# Altium schematic sheet Lampda_schematics_V1_1.schdoc
size 774 x 423 mm
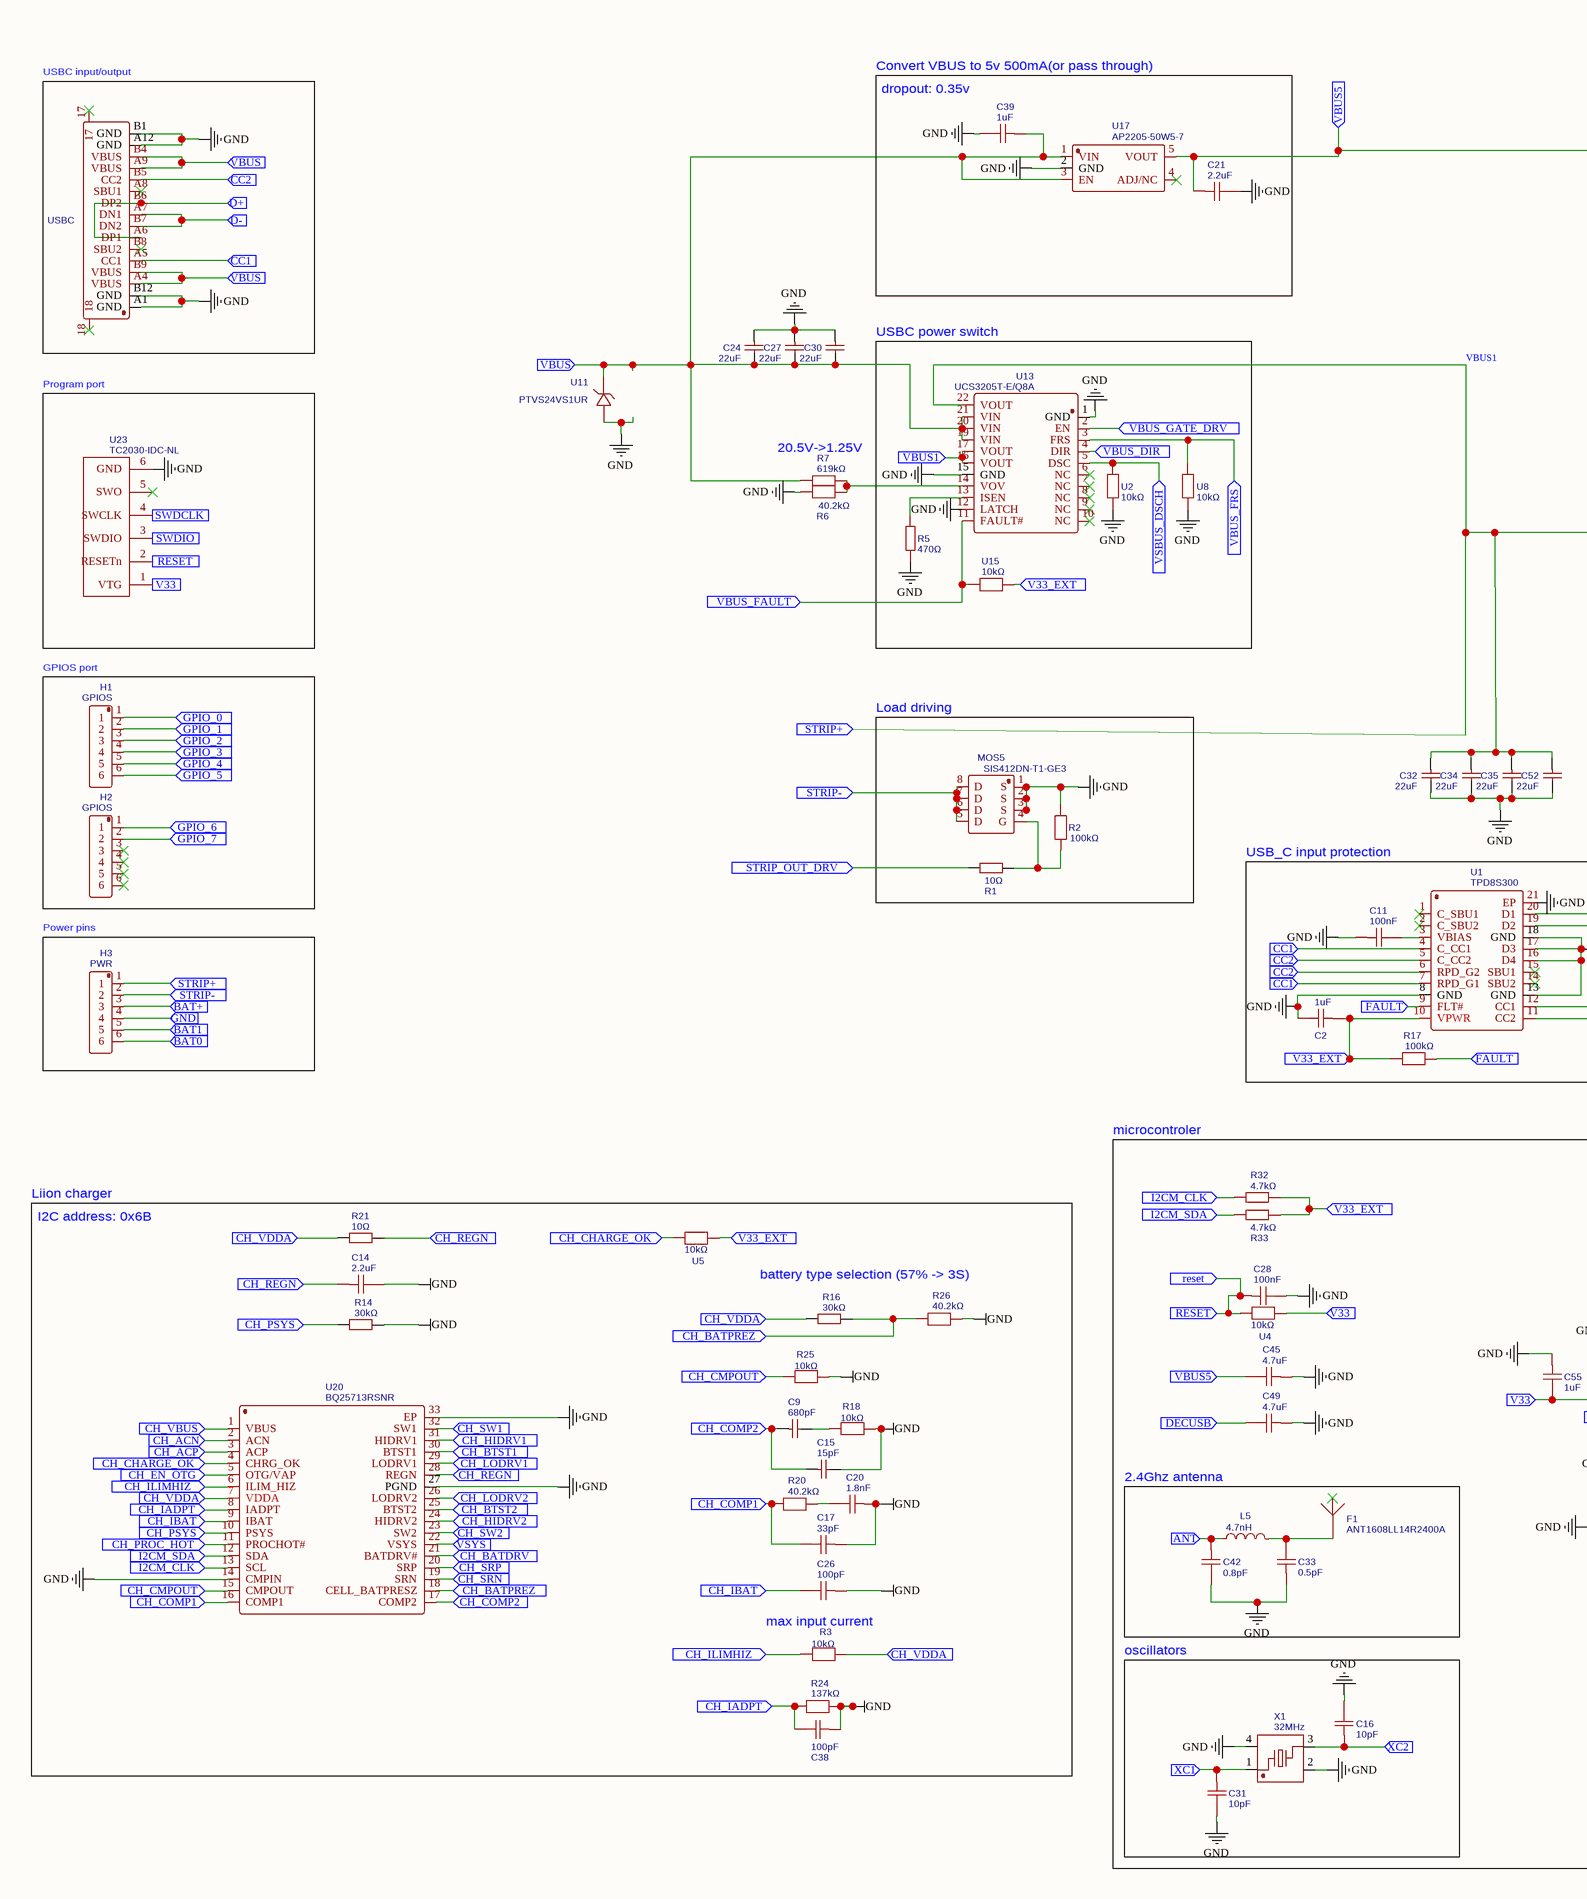
[diagram p0: Lampda_schematics_V1_1.schdoc, left]
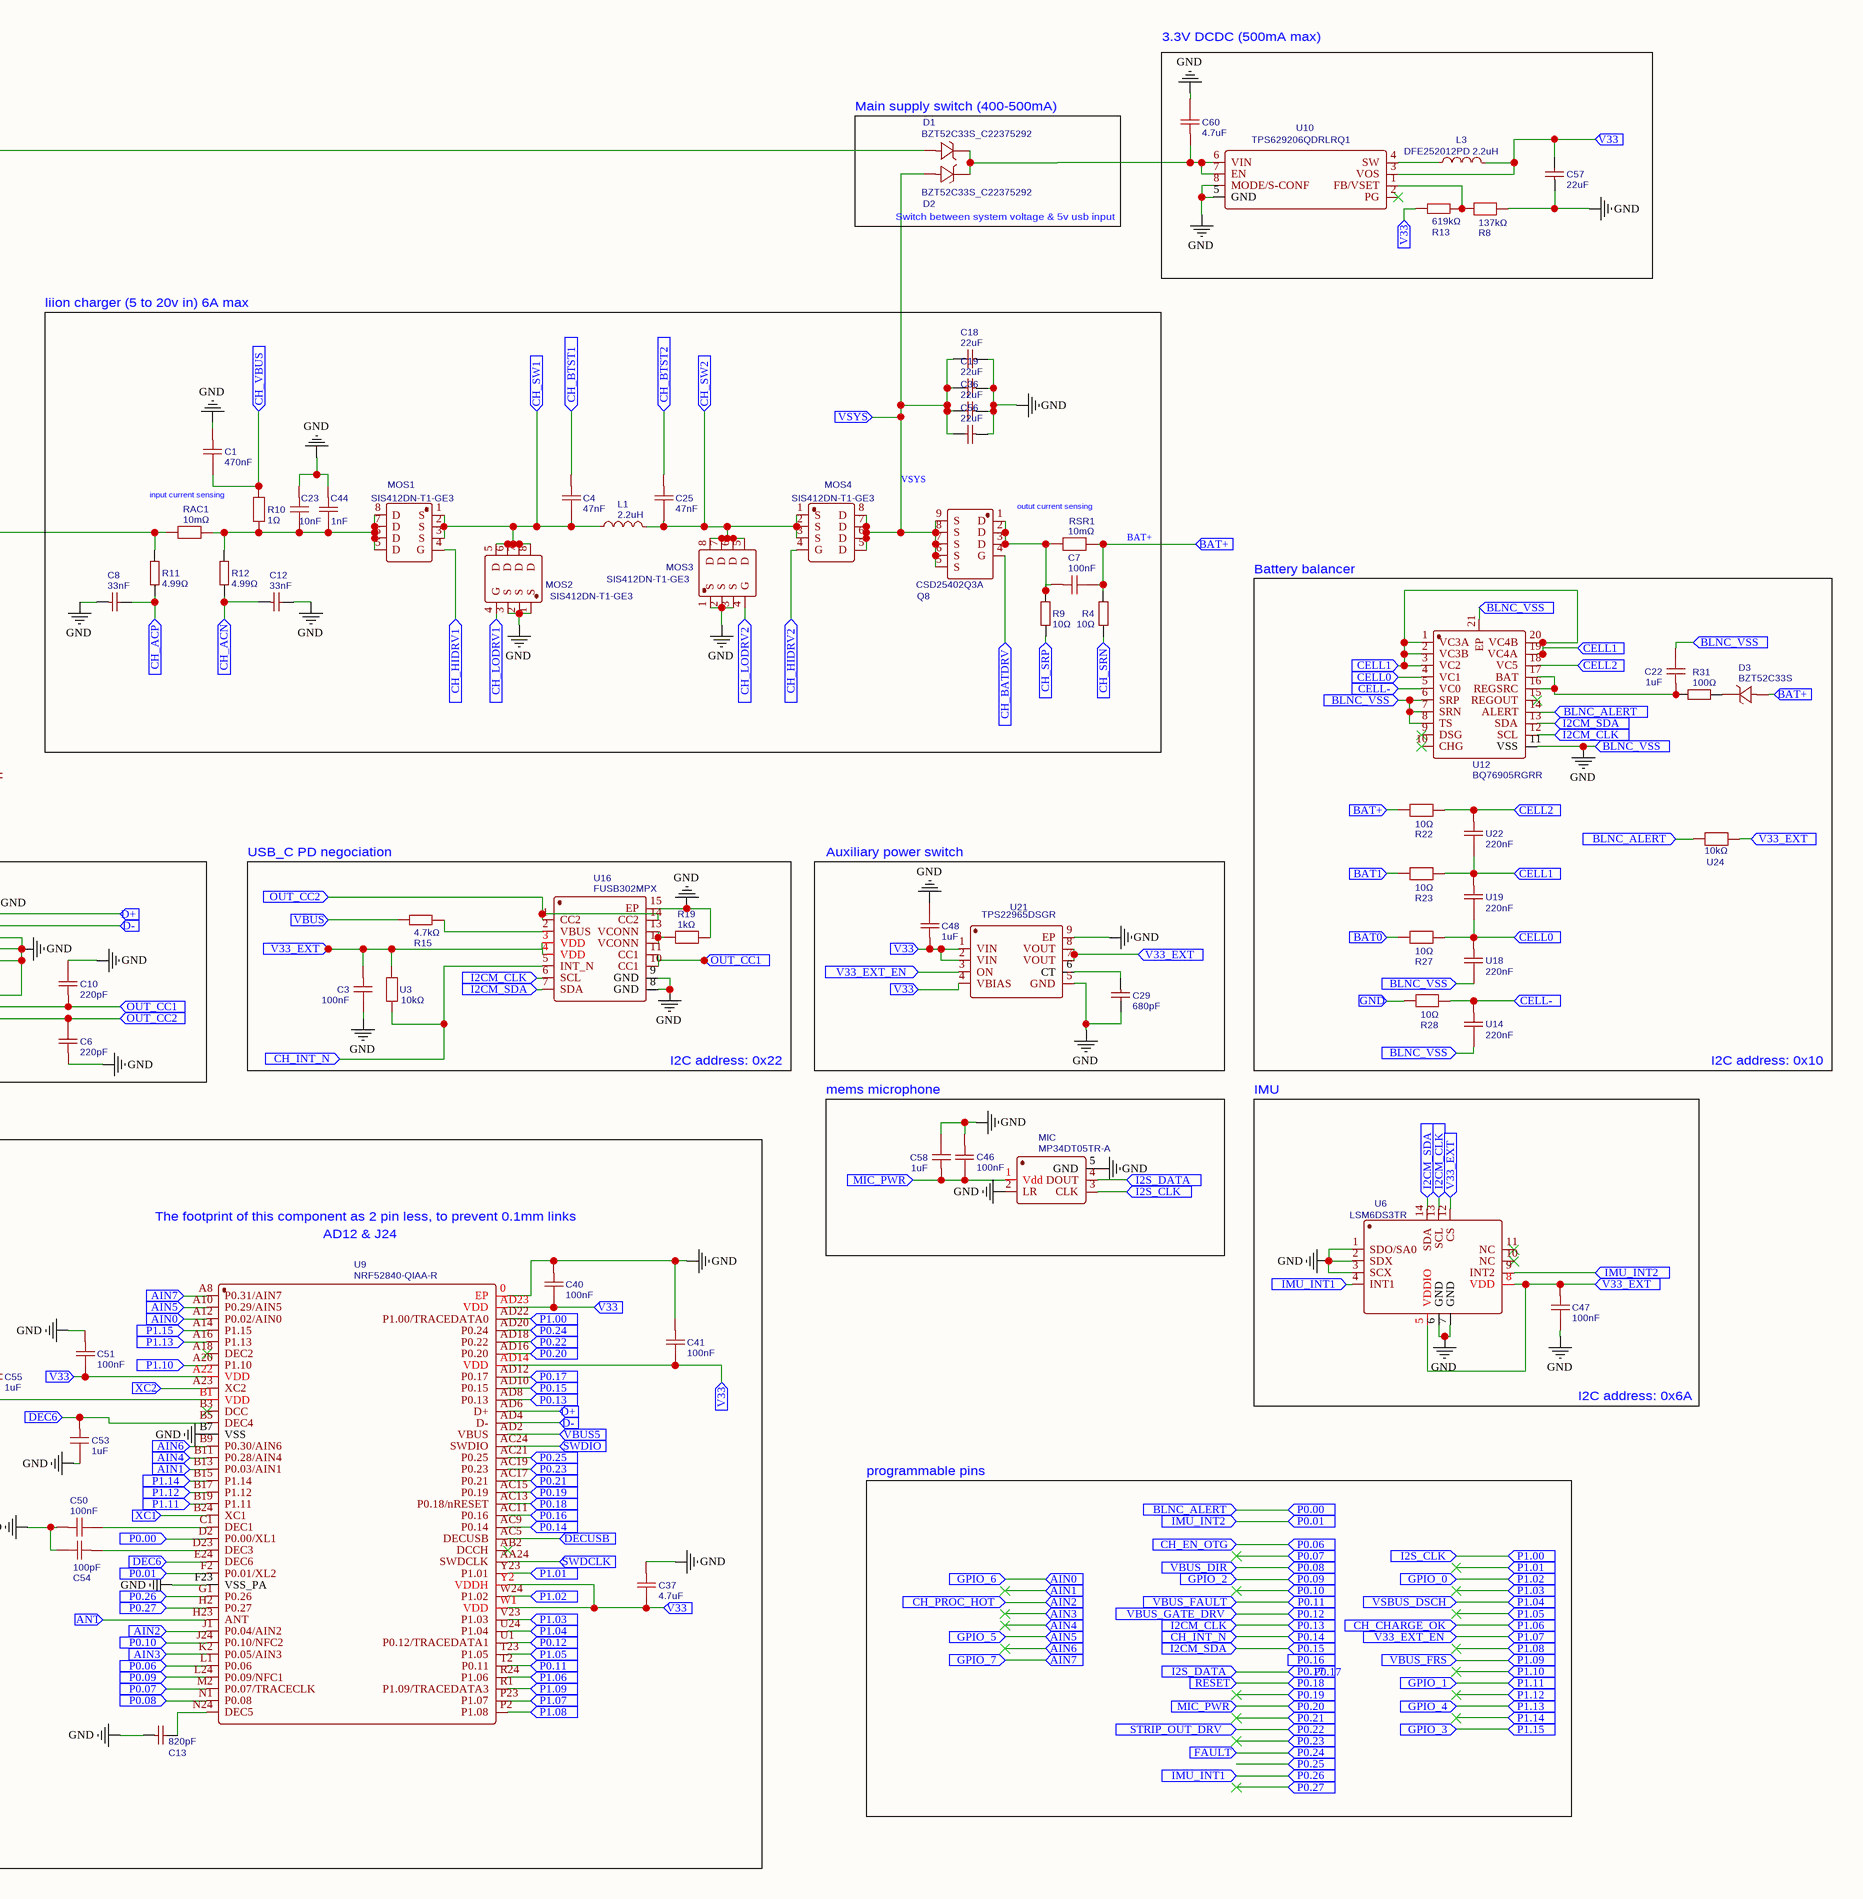
[diagram p1: Lampda_schematics_V1_1.schdoc, right]

## Parts
C1  470nF  [C0402]
C2  1uF  [C0402]
C3  100nF  [C0402]
C4  47nF  [C0402]
C6  220pF  [C0402]
C7  100nF  [C0402]
C8  33nF  [C0402]
C9  680pF  [C0402]
C10  220pF  [C0402]
C11  100nF  [C0402]
C12  33nF  [C0402]
C13  820pF  [C0402]
C14  2.2uF  [C0402]
C15  15pF  [C0402]
C16  10pF  [C0402]
C17  33pF  [C0402]
C18  22uF  [C0805]
C19  22uF  [C0805]
C20  1.8nF  [C0402]
C21  2.2uF  [C0402]
C22  1uF  [C0402]
C23  10nF  [C0402]
C24  22uF  [C0805]
C25  47nF  [C0402]
C26  100pF  [C0402]
C27  22uF  [C0805]
C28  100nF  [C0402]
C29  680pF  [C0402]
C30  22uF  [C0805]
C31  10pF  [C0402]
C32  22uF  [C0805]
C33  0.5pF  [C0402]
C34  22uF  [C0805]
C35  22uF  [C0805]
C36  22uF  [C0805]
C37  4.7uF  [C0603]
C38  100pF  [C0402]
C39  1uF  [C0402]
C40  100nF  [C0402]
C41  100nF  [C0402]
C42  0.8pF  [C0603]
C44  1nF  [C0402]
C45  4.7uF  [C0603]
C46  100nF  [C0402]
C47  100nF  [C0402]
C48  1uF  [C0402]
C49  4.7uF  [C0603]
C50  100nF  [C0402]
C51  100nF  [C0402]
C52  22uF  [C0805]
C53  1uF  [C0402]
C54  100pF  [C0402]
C55  1uF  [C0402]
C56  22uF  [C0805]
C57  22uF  [C0805]
C58  1uF  [C0402]
C60  4.7uF  [C0603]
D1  BZT52C33S_C22375292  [SOD-323_L1.9-W1.3-LS2.5-RD-1]
D2  BZT52C33S_C22375292  [SOD-323_L1.9-W1.3-LS2.5-RD-1]
D3  BZT52C33S  [SOD-323_L1.9-W1.3-LS2.5-RD-1]
F1  ANT1608LL14R2400A  [ANT-SMD_3P-L1.6-W0.8_ANT1608LL14R2400A]
H1  GPIOS  [GPIOS]
H2  GPIOS  [GPIOS]
H3  PWR  [GPIOS]
L1  2.2uH  [IND-SMD_L7.0-W6.6_FXL0630]
L3  DFE252012PD 2.2uH  [L1008]
L5  4.7nH  [L0402]
MIC  MP34DT05TR-A  [MIC-SMD_5P-L3.0-W4.0-P0.85-BL]
MOS1  SIS412DN-T1-GE3  [POWERPAK-1212-8_L3.0-W3.0-P0.65-LS3.3-BL]
MOS2  SIS412DN-T1-GE3  [POWERPAK-1212-8_L3.0-W3.0-P0.65-LS3.3-BL]
MOS3  SIS412DN-T1-GE3  [POWERPAK-1212-8_L3.0-W3.0-P0.65-LS3.3-BL]
MOS4  SIS412DN-T1-GE3  [POWERPAK-1212-8_L3.0-W3.0-P0.65-LS3.3-BL]
MOS5  SIS412DN-T1-GE3  [POWERPAK-1212-8_L3.0-W3.0-P0.65-LS3.3-BL]
Q8  CSD25402Q3A  [VSONP-8_L3.1-W3.1-P0.65-LS3.5-BL]
R1  10Ω  [R0402]
R2  100kΩ  [R0402]
R3  10kΩ  [R0402]
R4  10Ω  [R0402]
R5  470Ω  [R0402]
R6  40.2kΩ  [R0402]
R7  619kΩ  [R0402]
R8  137kΩ  [R0402]
R9  10Ω  [R0402]
R10  1Ω  [R0402]
R11  4.99Ω  [R0402]
R12  4.99Ω  [R0402]
R13  619kΩ  [R0402]
R14  30kΩ  [R0402]
R15  4.7kΩ  [R0402]
R16  30kΩ  [R0402]
R17  100kΩ  [R0402]
R18  10kΩ  [R0402]
R19  1kΩ  [R0402]
R20  40.2kΩ  [R0402]
R21  10Ω  [R0402]
R22  10Ω  [R0805]
R23  10Ω  [R0805]
R24  137kΩ  [R0402]
R25  10kΩ  [R0402]
R26  40.2kΩ  [R0402]
R27  10Ω  [R0805]
R28  10Ω  [R0805]
R31  100Ω  [R0402]
R32  4.7kΩ  [R0402]
R33  4.7kΩ  [R0402]
RAC1  10mΩ  [R1206]
RSR1  10mΩ  [R1206]
U1  TPD8S300  [WQFN-20_L3.0-W3.0-P0.40-TL-EP]
U2  10kΩ  [R0402]
U3  10kΩ  [R0402]
U4  10kΩ  [R0402]
U5  10kΩ  [R0402]
U6  LSM6DS3TR  [LGA-14_L3.0-W2.5-P0.50-TL]
U8  10kΩ  [R0402]
U9  NRF52840-QIAA-R  [AQFN-73_L7.0-W7.0-P0.50-BL-EP4.8]
U10  TPS629206QDRLRQ1  [SOT-583-8_L2.1-W1.6-P0.50-LS1.6-BL]
U11  PTVS24VS1UR  [SOD-123_L2.6-W1.7-LS3.5-RD]
U12  BQ76905RGRR  [VQFN-20_L3.5-W3.5-P0.50-TL-EP2.1]
U13  UCS3205T-E/Q8A  [VQFN-19_L3.0-W3.0-P0.50-TL-EP]
U14  220nF  [C0402]
U15  10kΩ  [R0402]
U16  FUSB302MPX  [MLP-14_L2.5-W2.5-P0.50-BL-EP]
U17  AP2205-50W5-7  [SOT-25-5_L2.9-W1.6-P0.95-LS2.8-BL]
U18  220nF  [C0402]
U19  220nF  [C0402]
U20  BQ25713RSNR  [QFN-32_L4.0-W4.0-P0.40-TL-EP2.8]
U21  TPS22965DSGR  [UDFN-8_L2.0-W2.0-P0.50-TL-EP]
U22  220nF  [C0402]
U23  TC2030-IDC-NL  [TC2030-IDC-NL]
U24  10kΩ  [R0402]
USBC  HYCW212-USBC16-650B  [USB-C-SMD_HYCW212-USBC16-650B]  (value not drawn)
X1  32MHz  [CRYSTAL-SMD_4P-L2.0-W1.6-BL]

## Blocks framed on the sheet
USBC input/output: USBC
3.3V DCDC (500mA max): C57 C60 L3 R8 R13 U10
Main supply switch (400-500mA): D1 D2
liion charger (5 to 20v in) 6A max: C1 C4 C7 C8 C12 C18 C19 C23 C25 C36 C44 C56 L1 MOS1-MOS4 Q8 R4 R9-R12 RAC1 RSR1
USBC power switch: R5 U2 U8 U13 U15
Program port: U23
GPIOS port: H1 H2
Load driving: MOS5 R1 R2
USB_C input protection: C2 C6 C10 C11 R17 U1
Auxiliary power switch: C29 C48 U21
Power pins: H3
mems microphone: C46 C58 MIC
2.4Ghz antenna: C33 C42 F1 L5
oscillators: C16 C31 X1

## Ports
AIN0 (in), AIN1 (in), AIN2 (in), AIN3 (in), AIN4 (in), AIN5 (in), AIN6 (in), AIN7 (in), ANT (in), BAT0 (in), BAT1 (in), BAT+ (in), BLNC_ALERT (in), BLNC_VSS (in), CC1 (in), CC2 (in), CELL0 (in), CELL1 (in), CELL2 (in), CELL- (in), CH_ACN (in), CH_ACP (in), CH_BATDRV (in), CH_BATPREZ (in), CH_BTST1 (in), CH_BTST2 (in), CH_CHARGE_OK (in), CH_CMPOUT (in), CH_COMP1 (in), CH_COMP2 (in), CH_EN_OTG (in), CH_HIDRV1 (in), CH_HIDRV2 (in), CH_IADPT (in), CH_IBAT (in), CH_ILIMHIZ (in), CH_INT_N (in), CH_LODRV1 (in), CH_LODRV2 (in), CH_PROC_HOT (in), CH_PSYS (in), CH_REGN (in), CH_SRN (in), CH_SRP (in), CH_SW1 (in), CH_SW2 (in), CH_VBUS (in), CH_VDDA (in), D+ (in), D- (in), DEC6 (in), DECUSB (in), FAULT (in), GND (in), GPIO_0 (in), GPIO_1 (in), GPIO_2 (in), GPIO_3 (in), GPIO_4 (in), GPIO_5 (in), GPIO_6 (in), GPIO_7 (in), I2CM_CLK (in), I2CM_SDA (in), I2S_CLK (in), I2S_DATA (in), IMU_INT1 (in), IMU_INT2 (in), MIC_PWR (in), OUT_CC1 (in), OUT_CC2 (in), P0.00 (in), P0.01 (in), P0.06 (in), P0.07 (in), P0.08 (in), P0.09 (in), P0.10 (in), P0.11 (in), P0.12 (in), P0.13 (in), P0.14 (in), P0.15 (in), P0.16 (in), P0.17 (in), P0.18 (in), P0.19 (in), P0.20 (in), P0.21 (in), P0.22 (in), P0.23 (in), P0.24 (in), P0.25 (in), P0.26 (in), P0.27 (in), P1.00 (in), P1.01 (in), P1.02 (in), P1.03 (in), P1.04 (in), P1.05 (in), P1.06 (in), P1.07 (in), P1.08 (in), P1.09 (in), P1.10 (in), P1.11 (in), P1.12 (in), P1.13 (in), P1.14 (in), P1.15 (in), reset (in), RESET (in), STRIP+ (in), STRIP- (in), STRIP_OUT_DRV (in), SWDCLK (in), SWDIO (in), V33 (in), V33_EXT (in), V33_EXT_EN (in), VBUS1 (in), VBUS5 (in), VBUS (in), VBUS_DIR (in), VBUS_FAULT (in), VBUS_FRS (in), VBUS_GATE_DRV (in), VSBUS_DSCH (in), VSYS (in), XC1 (in), XC2 (in)

## Nets
GND: C1.2 C2.1 C3.1 C6.2 C8.1 C10.1 C11.2 C12.2 C13.1 C14.1 C15.2 C16.1 C17.2 C18.1 C19.1 C20.2 C21.1 C22.1 C23.2 C24.1 C26.2 C27.1 C28.1 C29.2 C30.1 C31.1 C32.2 C33.2 C34.2 C35.2 C36.1 C37.2 C38.2 C39.1 C40.2 C41.2 C42.1 C44.2 C45.2 C46.2 C47.1 C48.1 C49.2 C50.2 C51.2 C52.2 C53.1 C54.1 C55.2 C56.1 C57.1 C58.1 C60.1 MIC.2(LR) MIC.5(GND) MOS2.1(S) MOS2.2(S) MOS2.3(S) MOS3.1(S) MOS3.2(S) MOS3.3(S) MOS5.1(S) MOS5.2(S) MOS5.3(S) R2.2 R5.1 R6.2 R8.2 R14.2 R18.2 R19.2 R24.2 R25.2 R26.2 U1.8(GND) U1.13(GND) U1.16(D4) U1.17(D3) U1.18(GND) U1.21(EP) U2.1 U6.1(SDO/SA0) U6.2(SDX) U6.3(SCX) U6.6(GND) U6.7(GND) U8.1 U9.0(EP) U9.B7(VSS) U9.F23(VSS_PA) U10.5(GND) U10.8(MODE/S-CONF) U11.2 U12.6(SRP) U12.7(SRN) U12.8(TS) U12.11(VSS) U12.21(EP) U13.1(GND) U13.12(LATCH) U13.15(GND) U14.1 U16.8(GND) U16.9(GND) U16.15(EP) U17.2(GND) U18.1 U20.14(CMPIN) U20.27(PGND) U20.33(EP) U21.5(GND) U21.9(EP) U23.6(GND) USBC.A1(GND) USBC.A12(GND) USBC.B1(GND) USBC.B12(GND) X1.2(GND) X1.4(GND) ; port BLNC_VSS
AIN0: H2.1 U9.A12(P0.02/AIN0) ; port AIN0, port GPIO_6
AIN1: U9.B13(P0.03/AIN1) ; port AIN1
AIN2: U9.J1(P0.04/AIN2) U20.11(PROCHOT#) ; port CH_PROC_HOT, port AIN2
AIN3: U9.K2(P0.05/AIN3) ; port AIN3
AIN4: U9.B11(P0.28/AIN4) ; port AIN4
AIN5: H1.6 U9.A10(P0.29/AIN5) ; port AIN5, port GPIO_5
AIN6: U9.B9(P0.30/AIN6) ; port AIN6
AIN7: H2.2 U9.A8(P0.31/AIN7) ; port AIN7, port GPIO_7
ANT: C42.2 L5.1 U9.H23(ANT) ; port ANT
BAT0: H3.6 R27.1 ; port BAT0
BAT1: H3.5 R23.1 ; port BAT1
BAT+: C7.1 D3.2(A) H3.3 R4.2 R22.1 RSR1.2 ; port BAT+
BLNC_ALERT: U9.D2(P0.00/XL1) U12.14(ALERT) U24.1 ; port P0.00, port BLNC_ALERT
CC1: U1.4(C_CC1) U1.7(RPD_G1) USBC.A5(CC1) ; port CC1
CC2: U1.5(C_CC2) U1.6(RPD_G2) USBC.B5(CC2) ; port CC2
CELL0: R27.2 U12.4(VC1) U18.2 U19.1 ; port CELL0
CELL1: R23.2 U12.1(VC3A) U12.2(VC3B) U12.3(VC2) U12.19(VC4A) U12.20(VC4B) U19.2 U22.1 ; port CELL1
CELL2: R22.2 U12.18(VC5) U22.2 ; port CELL2
CELL-: R28.2 U12.5(VC0) U14.2 ; port CELL-
CH_ACN: C12.1 R12.2 U20.2(ACN) ; port CH_ACN
CH_ACP: C8.2 R11.1 U20.3(ACP) ; port CH_ACP
CH_BATDRV: Q8.4(G) U20.21(BATDRV#) ; port CH_BATDRV
CH_BATPREZ: R16.2 R26.1 U20.18(CELL_BATPRESZ) ; port CH_BATPREZ
CH_BTST1: C4.2 U20.30(BTST1) ; port CH_BTST1
CH_BTST2: C25.2 U20.25(BTST2) ; port CH_BTST2
CH_CHARGE_OK: U5.1 U9.R24(P1.06) U20.4(CHRG_OK) ; port CH_CHARGE_OK, port P1.06
CH_CMPOUT: R25.1 U20.15(CMPOUT) ; port CH_CMPOUT
CH_COMP1: C17.1 R20.1 U20.16(COMP1) ; port CH_COMP1
CH_COMP2: C9.1 C15.1 U20.17(COMP2) ; port CH_COMP2
CH_EN_OTG: U9.L1(P0.06) U20.5(OTG/VAP) ; port CH_EN_OTG, port P0.06
CH_HIDRV1: MOS1.4(G) U20.31(HIDRV1) ; port CH_HIDRV1
CH_HIDRV2: MOS4.4(G) U20.24(HIDRV2) ; port CH_HIDRV2
CH_IADPT: C38.1 R24.1 U20.8(IADPT) ; port CH_IADPT
CH_IBAT: C26.1 U20.9(IBAT) ; port CH_IBAT
CH_ILIMHIZ: R3.1 U20.6(ILIM_HIZ) ; port CH_ILIMHIZ
CH_INT_N: U3.2 U9.AC9(P0.14) U16.5(INT_N) ; port CH_INT_N, port P0.14
CH_LODRV1: MOS2.4(G) U20.29(LODRV1) ; port CH_LODRV1
CH_LODRV2: MOS3.4(G) U20.26(LODRV2) ; port CH_LODRV2
CH_PSYS: R14.1 U20.10(PSYS) ; port CH_PSYS
CH_REGN: C14.2 R21.1 U20.28(REGN) ; port CH_REGN
CH_SRN: R4.1 U20.19(SRN) ; port CH_SRN
CH_SRP: R9.1 U20.20(SRP) ; port CH_SRP
CH_SW1: C4.1 L1.1 MOS1.1(S) MOS1.2(S) MOS1.3(S) MOS2.5(D) MOS2.6(D) MOS2.7(D) MOS2.8(D) U20.32(SW1) ; port CH_SW1
CH_SW2: C25.1 L1.2 MOS3.5(D) MOS3.6(D) MOS3.7(D) MOS3.8(D) MOS4.1(S) MOS4.2(S) MOS4.3(S) U20.23(SW2) ; port CH_SW2
CH_VBUS: C1.1 R10.2 U20.1(VBUS) ; port CH_VBUS
CH_VDDA: R3.2 R16.1 R21.2 U20.7(VDDA) ; port CH_VDDA
D+: U1.20(D1) U9.AD6(D+) USBC.A6(DP1) USBC.B6(DP2) ; port D+
D-: U1.19(D2) U9.AD4(D-) USBC.A7(DN1) USBC.B7(DN2) ; port D-
DEC6: C53.2 U9.B5(DEC4) U9.E24(DEC6) ; port DEC6
DECUSB: C49.1 U9.AC5(DECUSB) ; port DECUSB
FAULT: R17.1 U1.9(FLT#) U9.AD20(P0.24) ; port FAULT, port P0.24
GND: H3.4 R28.1 ; port GND  [a separate net that carries the same name]
GPIO_0: H1.1 U9.W24(P1.02) ; port P1.02, port GPIO_0
GPIO_1: H1.2 U9.B19(P1.11) ; port P1.11, port GPIO_1
GPIO_2: H1.3 U9.L24(P0.09/NFC1) ; port P0.09, port GPIO_2
GPIO_3: H1.4 U9.A14(P1.15) ; port P1.15, port GPIO_3
GPIO_4: H1.5 U9.A16(P1.13) ; port P1.13, port GPIO_4
I2CM_CLK: R32.1 U6.13(SCL) U9.AD8(P0.13) U12.12(SCL) U16.6(SCL) U20.13(SCL) ; port I2CM_CLK, port P0.13
I2CM_SDA: R33.1 U6.14(SDA) U9.AD10(P0.15) U12.13(SDA) U16.7(SDA) U20.12(SDA) ; port I2CM_SDA, port P0.15
I2S_CLK: MIC.3(CLK) U9.AD22(P1.00/TRACEDATA0) ; port I2S_CLK, port P1.00
I2S_DATA: MIC.4(DOUT) U9.AD12(P0.17) ; port I2S_DATA, port P0.17
IMU_INT1: U6.4(INT1) U9.G1(P0.26) ; port P0.26, port IMU_INT1
IMU_INT2: U6.9(INT2) U9.F2(P0.01/XL2) ; port IMU_INT2, port P0.01
MIC_PWR: C46.1 C58.2 MIC.1(Vdd) U9.AD16(P0.20) ; port P0.20, port MIC_PWR
OUT_CC1: C10.2 U1.12(CC1) U16.10(CC1) U16.11(CC1) ; port OUT_CC1
OUT_CC2: C6.1 U1.11(CC2) U16.1(CC2) U16.14(CC2) ; port OUT_CC2
P0.07: U9.M2(P0.07/TRACECLK) ; port P0.07
P0.08: U9.N1(P0.08) U13.4(DIR) ; port P0.08, port VBUS_DIR
P0.10: U9.J24(P0.10/NFC2) ; port P0.10
P0.11: U9.T2(P0.11) U13.11(FAULT#) U15.1 ; port P0.11, port VBUS_FAULT
P0.12: U9.U1(P0.12/TRACEDATA1) U13.2(EN) ; port VBUS_GATE_DRV, port P0.12
P0.16: U9.AC11(P0.16) ; port P0.16
P0.18: C28.2 U4.1 U9.AC13(P0.18/nRESET) U23.2(RESETn) ; port reset, port RESET, port P0.18
P0.19: U9.AC15(P0.19) ; port P0.19
P0.21: U9.AC17(P0.21) ; port P0.21
P0.22: R1.1 U9.AD18(P0.22) ; port STRIP_OUT_DRV, port P0.22
P0.23: U9.AC19(P0.23) ; port P0.23
P0.25: U9.AC21(P0.25) ; port P0.25
P0.27: U9.H2(P0.27) ; port P0.27
P1.01: U9.Y23(P1.01) ; port P1.01
P1.03: U9.V23(P1.03) ; port P1.03
P1.04: U2.2 U9.U24(P1.04) U13.5(DSC) ; port VSBUS_DSCH, port P1.04
P1.05: U9.T23(P1.05) ; port P1.05
P1.07: U9.P23(P1.07) U21.3(ON) ; port P1.07, port V33_EXT_EN
P1.08: U9.P2(P1.08) ; port P1.08
P1.09: U8.2 U9.R1(P1.09/TRACEDATA3) U13.3(FRS) ; port P1.09, port VBUS_FRS
P1.10: U9.A20(P1.10) ; port P1.10
P1.12: U9.B17(P1.12) ; port P1.12
P1.14: U9.B15(P1.14) ; port P1.14
STRIP-: H3.2 MOS5.5(D) MOS5.6(D) MOS5.7(D) MOS5.8(D) ; port STRIP-
SWDCLK: U9.AA24(SWDCLK) U23.4(SWCLK) ; port SWDCLK
SWDIO: U9.AC24(SWDIO) U23.3(SWDIO) ; port SWDIO
V33: C37.1 C40.1 C41.1 C48.2 C51.1 C55.1 C57.2 L3.2 R13.1 U4.2 U9.A22(VDD) U9.AD14(VDD) U9.AD23(VDD) U9.B1(VDD) U9.W1(VDD) U9.Y2(VDDH) U10.3(VOS) U21.1(VIN) U21.2(VIN) U21.4(VBIAS) U23.1(VTG) ; port V33
V33_EXT: C2.2 C3.2 C47.2 R17.2 R32.2 R33.2 U1.10(VPWR) U3.1 U5.2 U6.5(VDDIO) U6.8(VDD) U6.12(CS) U15.2 U16.3(VDD) U16.4(VDD) U21.7(VOUT) U21.8(VOUT) U24.2 ; port V33_EXT
VBUS: C24.2 C27.2 C30.2 C39.2 R7.2 R15.1 U11.1 U13.19(VIN) U13.20(VIN) U13.21(VIN) U17.1(VIN) U17.3(EN) USBC.A4(VBUS) USBC.A9(VBUS) USBC.B4(VBUS) USBC.B9(VBUS) ; port VBUS
VBUS1: C32.1 C34.1 C35.1 C52.1 H3.1 R11.2 RAC1.1 U13.22(VOUT) ; port STRIP+
VBUS1: U13.16(VOUT) U13.17(VOUT) ; port VBUS1  [a separate net that carries the same name]
VBUS5: C21.2 C45.1 D1.2(A) U9.AD2(VBUS) U17.5(VOUT) ; port VBUS5
VSYS: C18.2 C19.2 C36.2 C56.2 D2.2(A) MOS4.5(D) MOS4.6(D) MOS4.7(D) MOS4.8(D) Q8.5(S) Q8.6(S) Q8.7(S) Q8.8(S) Q8.9(S) U20.22(VSYS) ; port VSYS
XC1: C31.2 U9.B24(XC1) X1.1 ; port XC1
XC2: C16.2 U9.A23(XC2) X1.3 ; port XC2
NetC7_2: C7.2 Q8.1(D) Q8.2(D) Q8.3(D) R9.2 RSR1.1
NetC9_2: C9.2 R18.1
NetC11_1: C11.1 U1.3(VBIAS)
NetC13_2: C13.2 U9.N24(DEC5)
NetC20_1: C20.1 R20.2
NetC22_2: C22.2 R31.1 U12.16(REGSRC) U12.17(BAT)
NetC23_1: C23.1 C44.1 MOS1.5(D) MOS1.6(D) MOS1.7(D) MOS1.8(D) R10.1 R12.1 RAC1.2
NetC29_1: C29.1 U21.6(CT)
NetC33_1: C33.1 F1.1(ANT) L5.2
NetC50_1: C50.1 U9.C1(DEC1)
NetC54_2: C54.2 U9.D23(DEC3)
NetC60_2: C60.2 D1.1(K) D2.1(K) U10.6(VIN) U10.7(EN)
NetD3_1: D3.1(K) R31.2
NetL3_1: L3.1 U10.4(SW)
NetMOS5_4: MOS5.4(G) R1.2 R2.1
NetR5_2: R5.2 U13.13(ISEN)
NetR6_1: R6.1 R7.1 U13.14(VOV)
NetR8_1: R8.1 R13.2 U10.1(FB/VSET)
NetR15_2: R15.2 U16.2(VBUS)
NetR19_1: R19.1 U16.12(VCONN) U16.13(VCONN)

Not connected (* = marked no-connect by the designer): F1 2*; H2 3* 4* 5* 6*; U1 1(C_SBU1)* 2(C_SBU2)* 14(SBU2)* 15(SBU1)*; U6 10(NC)* 11(NC)*; U9 A18(DEC2)* AB2(DCCH)* B3(DCC)*; U10 2(PG)*; U12 9(DSG)* 10(CHG)* 15(REGOUT)*; U13 6(NC)* 7(NC)* 8(NC)* 9(NC)* 10(NC)*; U17 4(ADJ/NC)*; U23 5(SWO)*; USBC 17* 18* A8(SBU1)* B8(SBU2)*

## Notes on the sheet
- Convert VBUS to 5v 500mA(or pass through)
- (near C39) dropout: 0.35v
- (near D2) Switch between system voltage & 5v usb input
- 20.5V->1.25V
- input current sensing
- outut current sensing
- Battery balancer
- USB_C PD negociation
- I2C address: 0x22
- I2C address: 0x10
- IMU
- microcontroler
- Liion charger
- I2C address: 0x6B
- The footprint of this component as 2 pin less, to prevent 0.1mm links
- AD12 & J24
- battery type selection (57% -> 3S)
- I2C address: 0x6A
- programmable pins
- max input current
- P0.17

## Library data of the parts
C1 = 470nF: Manufacturer: YAGEO(国巨); Manufacturer Part: CC0402KRX5R9BB474; nameAlias: Value; Contributor: LCSC; Supplier: LCSC; Supplier Part: C513552; JLCPCB Part Class: Extended Part; spicePre: C; spiceSymbolName: CC0402KRX5R9BB474
C2 C22 C39 C48 C53 C55 C58 = 1uF: Manufacturer: Chinocera(华瓷); Manufacturer Part: HGC0402R5105K500NTEJ; nameAlias: Value; Contributor: lcsc; Supplier: LCSC; Supplier Part: C7472948; JLCPCB Part Class: Extended Part; spicePre: C; spiceSymbolName: HGC0402R5105K500NTEJ
C3 C7 C11 C28 C40 C41 C46 C47 C50 C51 = 100nF: Manufacturer: Walsin(华新科); Manufacturer Part: 0402B104K250CT; nameAlias: Value; Contributor: LCSC; Supplier: LCSC; Supplier Part: C301930; JLCPCB Part Class: Extended Part; spicePre: C; spiceSymbolName: 0402B104K250CT
C4 C25 = 47nF: Manufacturer: CCTC(三环); Manufacturer Part: TCC0402X7R473K500AT; nameAlias: Value; Contributor: lcsc; Supplier: LCSC; Supplier Part: C880605; JLCPCB Part Class: Extended Part; spicePre: C; spiceSymbolName: TCC0402X7R473K500AT
C6 C10 = 220pF: Manufacturer: CCTC(三环); Manufacturer Part: TCC0402X7R221K500AT; nameAlias: Value; Contributor: LCSC; Supplier: LCSC; Supplier Part: C466236; JLCPCB Part Class: Extended Part; spicePre: C; spiceSymbolName: TCC0402X7R221K500AT
C8 C12 = 33nF: Manufacturer: YAGEO(国巨); Manufacturer Part: CC0402KRX7R9BB333; nameAlias: Value; Supplier: LCSC; Supplier Part: C106862; JLCPCB Part Class: Extended Part; spicePre: C; spiceSymbolName: CC0402KRX7R9BB333
C9 C29 = 680pF: Manufacturer: FH(风华); Manufacturer Part: 0402B681K500NT; nameAlias: Value; Supplier: LCSC; Supplier Part: C1541; spicePre: C; spiceSymbolName: 0402B681K500NT
C13 = 820pF: Manufacturer: FH(风华); Manufacturer Part: 0402B821K500NT; nameAlias: Value; Supplier: LCSC; Supplier Part: C1543; JLCPCB Part Class: Extended Part; spicePre: C; spiceSymbolName: 0402B821K500NT
C14 C21 = 2.2uF: Manufacturer: KEMET(基美); Manufacturer Part: C0402C225M9PACTU; nameAlias: Value; Contributor: LCSC; Supplier: LCSC; Supplier Part: C452745; JLCPCB Part Class: Extended Part; spicePre: C; spiceSymbolName: C0402C225M9PACTU
C15 = 15pF: Manufacturer: FH(风华); Manufacturer Part: 0402CG150J500NT; nameAlias: Value; Supplier: LCSC; Supplier Part: C1548; JLCPCB Part Class: Basic Part; spicePre: C; spiceSymbolName: 0402CG150J500NT
C16 C31 = 10pF: Manufacturer: muRata(村田); Manufacturer Part: GJM1555C1H100JB01D; nameAlias: Value; Supplier: LCSC; Supplier Part: C85874; JLCPCB Part Class: Extended Part; spicePre: C; spiceSymbolName: GJM1555C1H100JB01D
C17 = 33pF: Manufacturer: Chinocera(华瓷); Manufacturer Part: HGC0402G0330J500NTEJ; nameAlias: Value; Contributor: LCSC; Supplier: LCSC; Supplier Part: C482484; JLCPCB Part Class: Extended Part; spicePre: C; spiceSymbolName: HGC0402G0330J500NTEJ
C18 C19 C24 C27 C30 C32 C34-C36 C52 C56 C57 = 22uF: Manufacturer: YAGEO(国巨); Manufacturer Part: CC0805MKX5R8BB226; nameAlias: Value; Contributor: lcsc; Supplier: LCSC; Supplier Part: C784585; JLCPCB Part Class: Extended Part; spicePre: C; spiceSymbolName: CC0805MKX5R8BB226
C20 = 1.8nF: Manufacturer: CCTC(三环); Manufacturer Part: TCC0402X7R182K500AT; nameAlias: Value; Contributor: LCSC; Supplier: LCSC; Supplier Part: C696873; JLCPCB Part Class: Extended Part; spicePre: C; spiceSymbolName: TCC0402X7R182K500AT
C23 = 10nF: Manufacturer: CCTC(三环); Manufacturer Part: TCC0402X7R103K500AT; nameAlias: Value; Contributor: LCSC; Supplier: LCSC; Supplier Part: C688874; JLCPCB Part Class: Extended Part; spicePre: C; spiceSymbolName: TCC0402X7R103K500AT
C26 C38 C54 = 100pF: Manufacturer: YAGEO(国巨); Manufacturer Part: CC0402JRX7R9BB101; nameAlias: Value; Contributor: LCSC; Supplier: LCSC; Supplier Part: C281750; JLCPCB Part Class: Extended Part; spicePre: C; spiceSymbolName: CC0402JRX7R9BB101
C33 = 0.5pF: Manufacturer: YAGEO(国巨); Manufacturer Part: CC0402CRNPO9BNR50; nameAlias: Value; Contributor: LCSC; Supplier: LCSC; Supplier Part: C327230; JLCPCB Part Class: Extended Part; spicePre: C; spiceSymbolName: CC0402CRNPO9BNR50
C37 C45 C49 C60 = 4.7uF: Manufacturer: CCTC(三环); Manufacturer Part: TCC0603X5R475K250CT; nameAlias: Value; Contributor: lcsc; Supplier: LCSC; Supplier Part: C5360844; JLCPCB Part Class: Extended Part; spicePre: C; spiceSymbolName: TCC0603X5R475K250CT
C42 = 0.8pF: Manufacturer: FH(风华); Manufacturer Part: 0603CG0R8C500NT; nameAlias: Value; Contributor: LCSC; Supplier: LCSC; Supplier Part: C501845; JLCPCB Part Class: Extended Part; spicePre: C; spiceSymbolName: 0603CG0R8C500NT
C44 = 1nF: Manufacturer: YAGEO(国巨); Manufacturer Part: CC0402KRX7R8BB102; nameAlias: Value; Contributor: LCSC; Supplier: LCSC; Supplier Part: C541372; JLCPCB Part Class: Extended Part; spicePre: C; spiceSymbolName: CC0402KRX7R8BB102
D1 D2 = BZT52C33S_C22375292: Manufacturer: 宏嘉诚; Contributor: lcsc; Supplier: LCSC; Supplier Part: C22375292; Manufacturer Part: BZT52C33S; JLCPCB Part Class: Extended Part; spicePre: D; spiceSymbolName: BZT52C33S_C22375292
D3 = BZT52C33S: Manufacturer: 宏嘉诚; Contributor: lcsc; Supplier: LCSC; Supplier Part: C22375292; Manufacturer Part: BZT52C33S; JLCPCB Part Class: Extended Part; spicePre: D; spiceSymbolName: BZT52C33S_C22375292
F1 = ANT1608LL14R2400A: Manufacturer: YAGEO(国巨); Contributor: LCSC; Supplier: LCSC; Supplier Part: C723550; Manufacturer Part: ANT1608LL14R2400A; JLCPCB Part Class: Extended Part; spicePre: F; spiceSymbolName: ANT1608LL14R2400A
H1 H2 = GPIOS: Contributor: Ankit Jangid; spicePre: H; spiceSymbolName: FREE GPIOS
H3 = PWR: Contributor: Ankit Jangid; spicePre: H; spiceSymbolName: FREE GPIOS
L1 = 2.2uH: Manufacturer: cjiang(长江微电); Manufacturer Part: FXL0618-2R2-M; nameAlias: Value; Contributor: LCSC; Supplier: LCSC; Supplier Part: C524593; JLCPCB Part Class: Extended Part; spicePre: L; spiceSymbolName: FXL0618-2R2-M
L3 = DFE252012PD 2.2uH: Manufacturer: muRata(村田); Manufacturer Part: DFE252012PD-2R2M=P2; nameAlias: Value; Contributor: LCSC; Supplier: LCSC; Supplier Part: C237482; JLCPCB Part Class: Extended Part; spicePre: L; spiceSymbolName: DFE252012PD-2R2M=P2
L5 = 4.7nH: Manufacturer: chilisin(奇力新); Manufacturer Part: CLH1005T-4N7S-S-NP; nameAlias: Value; Supplier: LCSC; Supplier Part: C142221; JLCPCB Part Class: Extended Part; spicePre: L; spiceSymbolName: CLH1005T-4N7S-S-NP
MIC = MP34DT05TR-A: Manufacturer: ST(意法半导体); Contributor: LCSC; Supplier: LCSC; Supplier Part: C2688664; Manufacturer Part: MP34DT05TR-A; JLCPCB Part Class: Extended Part; spicePre: M; spiceSymbolName: MP34DT05TR-A
MOS1-MOS5 = SIS412DN-T1-GE3: Manufacturer: VISHAY(威世); Supplier: LCSC; Manufacturer Part: SIS412DN-T1-GE3; Supplier Part: C111309; JLCPCB Part Class: Extended Part; spicePre: Q; spiceSymbolName: SIS412DN-T1-GE3
Q8 = CSD25402Q3A: Manufacturer: TI(德州仪器); Supplier: LCSC; Manufacturer Part: CSD25402Q3A; Supplier Part: C111356; JLCPCB Part Class: Extended Part; spicePre: Q; spiceSymbolName: CSD25402Q3A
R1 R4 R9 R21 = 10Ω: Manufacturer: UNI-ROYAL(厚声); Manufacturer Part: 0402WGF100JTCE; nameAlias: Value; Supplier: LCSC; Supplier Part: C25077; JLCPCB Part Class: Basic Part; spicePre: R; spiceSymbolName: 0402WGF100JTCE
R2 R17 = 100kΩ: Manufacturer: EVER OHMS(天二科技); Manufacturer Part: CR0402F100KQ10Z; Contributor: LCSC; nameAlias: Value; Supplier: LCSC; Supplier Part: C881385; JLCPCB Part Class: Extended Part; spicePre: R; spiceSymbolName: CR0402F100KQ10Z
R3 R18 R25 U2-U5 U8 U15 U24 = 10kΩ: Manufacturer: RALEC(旺诠); Manufacturer Part: RAT021002FTH; Contributor: lcsc; nameAlias: Value; Supplier: LCSC; Supplier Part: C5119777; JLCPCB Part Class: Extended Part; spicePre: U; spiceSymbolName: RAT021002FTH
R5 = 470Ω: Manufacturer: RESI(开步睿思); Manufacturer Part: AECR0402F470RK9; nameAlias: Value; Contributor: LCSC; Supplier: LCSC; Supplier Part: C352415; JLCPCB Part Class: Extended Part; spicePre: R; spiceSymbolName: AECR0402F470RK9
R6 R20 R26 = 40.2kΩ: Manufacturer: EVER OHMS(天二科技); Manufacturer Part: CR0402F40K2Q10Z; Contributor: LCSC; nameAlias: Value; Supplier: LCSC; Supplier Part: C881147; JLCPCB Part Class: Extended Part; spicePre: R; spiceSymbolName: CR0402F40K2Q10Z
R7 R13 = 619kΩ: Manufacturer: YAGEO(国巨); Manufacturer Part: RC0402FR-07619KL; nameAlias: Value; Contributor: LCSC; Supplier: LCSC; Supplier Part: C327332; JLCPCB Part Class: Extended Part; spicePre: R; spiceSymbolName: RC0402FR-07619KL
R8 R24 = 137kΩ: Manufacturer: UNI-ROYAL(厚声); Manufacturer Part: TC0250D1373TCE; Contributor: lcsc; nameAlias: Value; Supplier: LCSC; Supplier Part: C778430; JLCPCB Part Class: Extended Part; spicePre: R; spiceSymbolName: TC0250D1373TCE
R10 = 1Ω: Manufacturer: EVER OHMS(天二科技); Manufacturer Part: CR0402F1R00Q10Z; Contributor: LCSC; nameAlias: Value; Supplier: LCSC; Supplier Part: C881121; JLCPCB Part Class: Extended Part; spicePre: R; spiceSymbolName: CR0402F1R00Q10Z
R11 R12 = 4.99Ω: Manufacturer: UNI-ROYAL(厚声); Manufacturer Part: 0402WGF499KTCE; nameAlias: Value; Supplier: LCSC; Supplier Part: C25122; JLCPCB Part Class: Extended Part; spicePre: R; spiceSymbolName: 0402WGF499KTCE
R14 R16 = 30kΩ: Manufacturer: UNI-ROYAL(厚声); Manufacturer Part: 0402WGF3002TCE; nameAlias: Value; Supplier: LCSC; Supplier Part: C25776; JLCPCB Part Class: Extended Part; spicePre: R; spiceSymbolName: 0402WGF3002TCE
R15 R32 R33 = 4.7kΩ: Manufacturer: Tyohm(幸亚电阻); Manufacturer Part: RMC04024K7JN; nameAlias: Value; Contributor: LCSC; Supplier: LCSC; Supplier Part: C269679; JLCPCB Part Class: Extended Part; spicePre: R; spiceSymbolName: RMC04024.7K5%N
R19 = 1kΩ: Manufacturer: VO(翔胜); Manufacturer Part: SCR0402F1K; Contributor: lcsc; nameAlias: Value; Supplier: LCSC; Supplier Part: C3015791; JLCPCB Part Class: Extended Part; spicePre: R; spiceSymbolName: SCR0402F1K
R22 R23 R27 R28 = 10Ω: Manufacturer: Viking(光颉); Manufacturer Part: RAM05FTDW0100; nameAlias: Value; Contributor: lcsc; Supplier: LCSC; Supplier Part: C2992488; JLCPCB Part Class: Extended Part; spicePre: R; spiceSymbolName: RAM05FTDW0100
R31 = 100Ω: Manufacturer: UNI-ROYAL(厚声); Manufacturer Part: 0402WGJ0101TCE; nameAlias: Value; Supplier: LCSC; Supplier Part: C25138; JLCPCB Part Class: Extended Part; spicePre: R; spiceSymbolName: 0402WGJ0101TCE
RAC1 RSR1 = 10mΩ: Manufacturer: Milliohm(毫欧); Manufacturer Part: HoJLR1206-1W-10mR-1%; nameAlias: Value; Contributor: LCSC; Supplier: LCSC; Supplier Part: C2903499; JLCPCB Part Class: Extended Part; spicePre: R; spiceSymbolName: HOJLR1206-1W-10MR-1%
U1 = TPD8S300: Manufacturer: TI(德州仪器); Manufacturer Part: TPD8S300RUKR; Contributor: LCSC; Supplier: LCSC; Supplier Part: C571205; JLCPCB Part Class: Extended Part; spicePre: U; spiceSymbolName: TPD8S300RUKR
U6 = LSM6DS3TR: Manufacturer: ST(意法半导体); Contributor: LCSC; Supplier: LCSC; Supplier Part: C95230; Manufacturer Part: LSM6DS3TR; JLCPCB Part Class: Extended Part; spicePre: U; spiceSymbolName: LSM6DS3TR
U9 = NRF52840-QIAA-R: Manufacturer: NORDIC; Contributor: LCSC; nameAlias: Value; Supplier: LCSC; Supplier Part: C190794; Manufacturer Part: NRF52840-QIAA-R; JLCPCB Part Class: Extended Part; spicePre: U; spiceSymbolName: NRF52840-QIAA-R
U10 = TPS629206QDRLRQ1: Manufacturer: TI(德州仪器); Contributor: lcsc; Supplier: LCSC; Supplier Part: C5219296; Manufacturer Part: TPS629206QDRLRQ1; JLCPCB Part Class: Extended Part; spicePre: U; spiceSymbolName: TPS629206QDRLRQ1
U11 = PTVS24VS1UR: Manufacturer: FUXINSEMI(富芯森美); Contributor: lcsc; Supplier: LCSC; Supplier Part: C5380693; Manufacturer Part: PTVS24VS1UR; JLCPCB Part Class: Extended Part; spicePre: U; spiceSymbolName: PTVS24VS1UR
U12 = BQ76905RGRR: Manufacturer: TI(德州仪器); Contributor: lcsc; Supplier: LCSC; Supplier Part: C22394458; Manufacturer Part: BQ76905RGRR; JLCPCB Part Class: Extended Part; spicePre: U; spiceSymbolName: BQ76905RGRR
U13 = UCS3205T-E/Q8A: Manufacturer: MICROCHIP(美国微芯); Contributor: LCSC; Supplier: LCSC; Supplier Part: C1518729; Manufacturer Part: UCS3205T-E/Q8A; JLCPCB Part Class: Extended Part; spicePre: U; spiceSymbolName: UCS3205T-E/Q8A
U14 U18 U19 U22 = 220nF: Manufacturer: FOJAN(富捷); Manufacturer Part: FCC0402X224K160AT; nameAlias: Value; Contributor: lcsc; Supplier: LCSC; Supplier Part: C5137633; JLCPCB Part Class: Extended Part; spicePre: U; spiceSymbolName: FCC0402X224K160AT
U16 = FUSB302MPX: Manufacturer: onsemi(安森美); Contributor: LCSC; Supplier: LCSC; Supplier Part: C442699; Manufacturer Part: Fusb302mpx; JLCPCB Part Class: Extended Part; spicePre: U; spiceSymbolName: FUSB302MPX
U17 = AP2205-50W5-7: Manufacturer: DIODES(美台); Contributor: lcsc; Supplier: LCSC; Supplier Part: C5378676; Manufacturer Part: AP2205-50W5-7; JLCPCB Part Class: Extended Part; spicePre: U; spiceSymbolName: AP2205-50W5-7
U20 = BQ25713RSNR: Manufacturer: TI(德州仪器); Contributor: LCSC; Supplier: LCSC; Supplier Part: C2878935; Manufacturer Part: BQ25713RSNR; JLCPCB Part Class: Extended Part; spicePre: U; spiceSymbolName: BQ25713RSNR
U21 = TPS22965DSGR: Manufacturer: TI(德州仪器); Supplier: LCSC; Manufacturer Part: TPS22965DSGR; Supplier Part: C122837; JLCPCB Part Class: Extended Part; spicePre: U; spiceSymbolName: TPS22965DSGR
U23 = TC2030-IDC-NL: Contributor: Intector; spicePre: U; spiceSymbolName: TC2030-IDC-NL
USBC = HYCW212-USBC16-650B: Manufacturer: 华宇创; Contributor: lcsc; Supplier: LCSC; Supplier Part: C3034191; Manufacturer Part: HYCW212-USBC16-650B; JLCPCB Part Class: Extended Part; spicePre: U; spiceSymbolName: HYCW212-USBC16-650B
X1 = 32MHz: Manufacturer: EPSON(爱普生); Manufacturer Part: Q22FA12800025; nameAlias: Value; Contributor: LCSC; Supplier: LCSC; Supplier Part: C187794; JLCPCB Part Class: Extended Part; spicePre: X; spiceSymbolName: Q22FA12800025